# EAGLE schematic Soprano2G-IMU-173 (EAGLE 9.1.3)
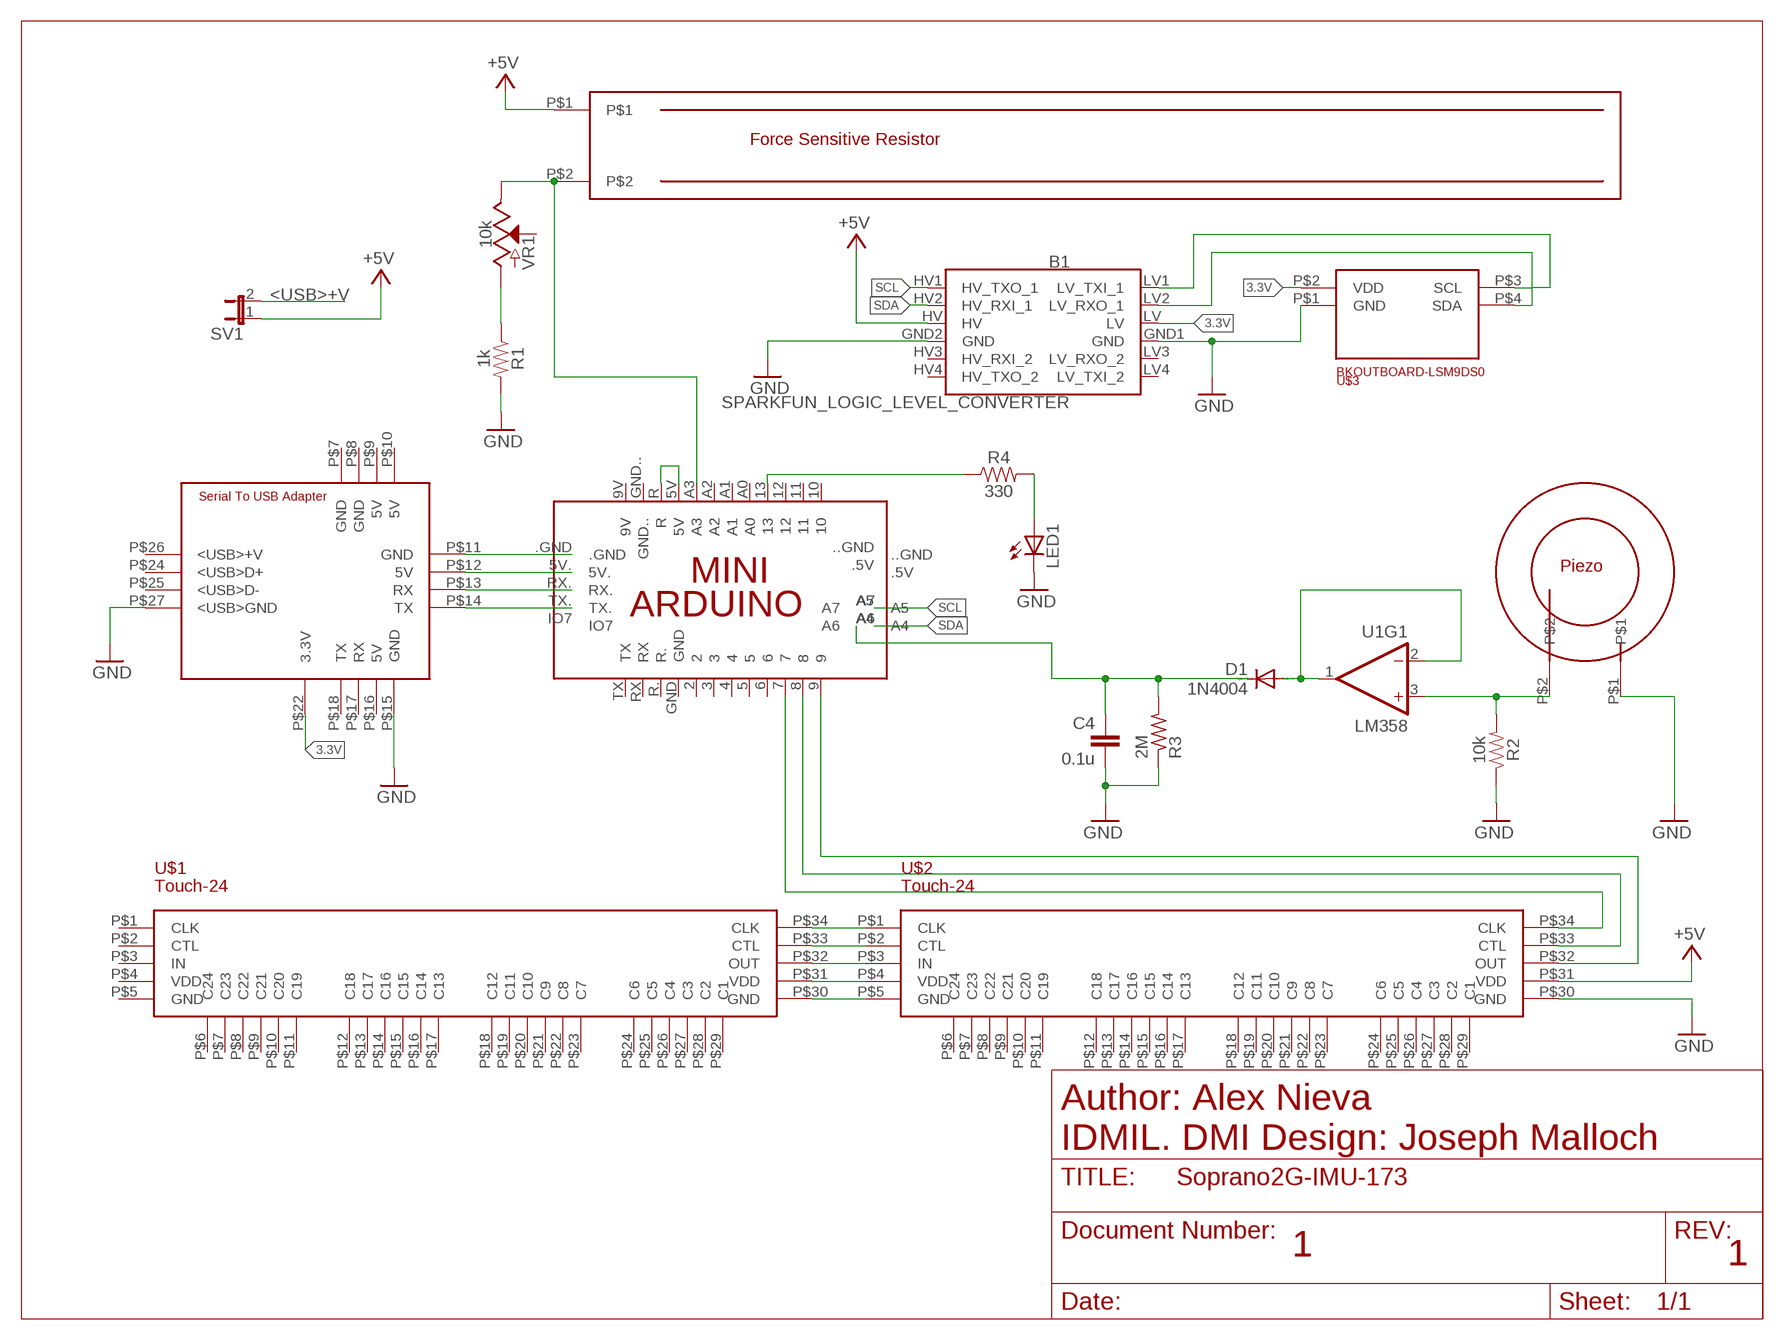
[diagram p0: schematic, sheet 1]

## Parts
B1  SPARKFUN_LOGIC_LEVEL_CONVERTER  [SPARKFUN_LOGIC_LEVEL_CONVERTER]
C4  0.1u  C5/5.5  [C5B5.5]
D1  1N4004  [DO41-10]
LED1  LED3MM  [LED3MM]
PCB1  ARDUINO_MINI  [ARDUINO_MINI]
R1  1k  1KOHM-HORIZ-1/4W-1%  [AXIAL-0.3]
R2  10k  10KOHM-HORIZ-1/4W-1%  [AXIAL-0.3]
R3  2M  R-US_0204/7  [0204/7]
R4  330  1KOHM-HORIZ-1/4W-1%  [AXIAL-0.3]
SV1  JP1E  [JP1]
U1  LM358  [DIP08]
U$1  TOUCH-24TOUCH-24  [TOUCH24]
U$2  TOUCH-24TOUCH-24  [TOUCH24]
U$3  LSM9DS0_IDMIL_BKOUTBOARD  [LSM9DS0_IDMIL_BKOUTBOARD]
U$4  SERIAL_TO_USB_ARDUINO_MINI  [SERIAL_TO_USB_ARDUINO]
U$5  FSR_T-STICK  [FSR_T-STICK]
U$6  PIEZO_TSTICK  [PIEZO_TSTICK]
VR1  10k  POTENTIOMETER-PTH-9MM-1/20W-20%  [POT-PTH-ALPS]

## Nets
3.3V: B1.LV U$3.P$2(VDD) U$4.P$22(3.3V)
+5V [power]: B1.HV PCB1.5V. SV1.1 U$2.P$31(VDD) U$4.P$12(5V) U$5.P$1
<USB>+V [usbvcc]: SV1.2
GND: B1.GND1(GND) B1.GND2(GND) C4.2 LED1.K(C) R1.P$2 R2.P$1 R3.1 U$2.P$30(GND) U$3.P$1(GND) U$4.P$15(GND) U$4.P$27(<USB>GND) U$6.P$1
N$1: U$1.P$34(CLK) U$2.P$1(CLK)
N$2: U$1.P$33(CTL) U$2.P$2(CTL)
N$3: U$1.P$32(OUT) U$2.P$3(IN)
N$4: U$1.P$31(VDD) U$2.P$4(VDD)
N$5: U$1.P$30(GND) U$2.P$5(GND)
N$6: PCB1..GND U$4.P$11(GND)
N$8: PCB1.RX. U$4.P$13(RX)
N$9: PCB1.TX. U$4.P$14(TX)
N$10: PCB1.13 R4.P$1
N$11: LED1.A R4.P$2
N$12: R1.P$1 VR1.P$3(A)
N$13: PCB1.A3 U$5.P$2 VR1.P$1(E)
N$14: D1.A U1.1(OUT) U1.2(-IN)
N$15: C4.1 D1.C PCB1.A6 R3.2
N$16: R2.P$2 U1.3(+IN) U$6.P$2
N$17: PCB1.7 U$2.P$34(CLK)
N$18: PCB1.5V PCB1.R
N$19: PCB1.8 U$2.P$33(CTL)
N$20: PCB1.9 U$2.P$32(OUT)
SCL: B1.HV1(HV_TXO_1) B1.LV1(LV_TXI_1) PCB1.A5 U$3.P$3(SCL)
SDA: B1.HV2(HV_RXI_1) B1.LV2(LV_RXO_1) PCB1.A4 U$3.P$4(SDA)
Unconnected: B1.HV3(HV_RXI_2) B1.HV4(HV_TXO_2) B1.LV3(LV_RXO_2) B1.LV4(LV_TXI_2) PCB1.2 PCB1.3 PCB1.4 PCB1.5 PCB1.6 PCB1.9V PCB1.10 PCB1.11 PCB1.12 PCB1..5V PCB1...GND PCB1.A0 PCB1.A1 PCB1.A2 PCB1.A7 PCB1.GND PCB1.GND.. PCB1.IO7 PCB1.R. PCB1.RX PCB1.TX U1.4(P$V-) U1.5(+IN) U1.6(-IN) U1.7(OUT) U1.8(P$V+) U$1.P$1(CLK) U$1.P$2(CTL) U$1.P$3(IN) U$1.P$4(VDD) U$1.P$5(GND) U$1.P$6(C24) U$1.P$7(C23) U$1.P$8(C22) U$1.P$9(C21) U$1.P$10(C20) U$1.P$11(C19) U$1.P$12(C18) U$1.P$13(C17) U$1.P$14(C16) U$1.P$15(C15) U$1.P$16(C14) U$1.P$17(C13) U$1.P$18(C12) U$1.P$19(C11) U$1.P$20(C10) U$1.P$21(C9) U$1.P$22(C8) U$1.P$23(C7) U$1.P$24(C6) U$1.P$25(C5) U$1.P$26(C4) U$1.P$27(C3) U$1.P$28(C2) U$1.P$29(C1) U$2.P$6(C24) U$2.P$7(C23) U$2.P$8(C22) U$2.P$9(C21) U$2.P$10(C20) U$2.P$11(C19) U$2.P$12(C18) U$2.P$13(C17) U$2.P$14(C16) U$2.P$15(C15) U$2.P$16(C14) U$2.P$17(C13) U$2.P$18(C12) U$2.P$19(C11) U$2.P$20(C10) U$2.P$21(C9) U$2.P$22(C8) U$2.P$23(C7) U$2.P$24(C6) U$2.P$25(C5) U$2.P$26(C4) U$2.P$27(C3) U$2.P$28(C2) U$2.P$29(C1) U$4.P$7(GND) U$4.P$8(GND) U$4.P$9(5V) U$4.P$10(5V) U$4.P$16(5V) U$4.P$17(RX) U$4.P$18(TX) U$4.P$24(<USB>D+) U$4.P$25(<USB>D-) U$4.P$26(<USB>+V) VR1.P$2(S)

## Notes on the sheet
- Author: Alex Nieva
  IDMIL. DMI Design: Joseph Malloch
- 1 | 1

## Library data of the parts
B1 = SparkFun-Boards:SPARKFUN_LOGIC_LEVEL_CONVERTER: SparkFun Logic Level Converter -Bi-Directional This is the mechnical outline for the 3.3V - 5V bi directional logic level converter. *Note, the "LOCK" Package has the header pins staggered by an offset of 5 mils (off center line), so that when you slide a row of standard 0.1" headers into the PTH pads, it will hold position vertically. See the follwing turorial for more information on this type of special footprints: Sneaky Footprints <https://www.sparkfun.com/tutorials/114> SparkFun Products: SparkFun Logic Level Converter - Bi-Directional <https://www.sparkfun.com/products/12009>
C4 = capacitor-wima:C: CAPACITOR naming: grid - package width
D1 = diode:1N4004: DIODE general purpose rectifier, 1 A
LED1 = led:LED: LED OSRAM: - CHIPLED LG R971, LG N971, LY N971, LG Q971, LY Q971, LO R971, LY R971 LH N974, LH R974 LS Q976, LO Q976, LY Q976 LO Q996 - Hyper CHIPLED LW Q18S LB Q993, LB Q99A, LB R99A - SideLED LS A670, LO A670, LY A670, LG A670, LP A670 LB A673, LV A673, LT A673, LW A673 LH A674 LY A675 LS A676, LA A676, LO A676, LY A676, LW A676 LS A679, LY A679, LG A679 - Hyper Micro SIDELED® LS Y876, LA Y876, LO Y876, LY Y876 LT Y87S - SmartLED LW L88C, LW L88S LB L89C, LB L89S, LG L890 LS L89K, LO L89K, LY L89K LS L896, LA L896, LO L896, LY L896 - TOPLED LS T670, LO T670, LY T670, LG T670, LP T670 LSG T670, LSP T670, LSY T670, LOP T670, LYG T670 LG T671, LOG T671, LSG T671 LB T673, LV T673, LT T673, LW T673 LH T674 LS T676, LA T676, LO T676, LY T676, LB T676, LH T676, LSB T676, LW T676 LB T67C, LV T67C, LT T67C, LS T67K, LO T67K, LY T67K, LW E67C LS E67B, LA E67B, LO E67B, LY E67B, LB E67C, LV E67C, LT E67C LW T67C LS T679, LY T679, LG T679 LS T770, LO T770, LY T770, LG T770, LP T770 LB T773, LV T773, LT T773, LW T773 LH T774 LS E675, LA E675, LY E675, LS T675 LS T776, LA T776, LO T776, LY T776, LB T776 LHGB T686 LT T68C, LB T68C - Hyper Mini TOPLED® LB M676 - Mini TOPLED Santana® LG M470 LS M47K, LO M47K, LY M47K Source: http://www.osram.convergy.de LUXEON: - LUMILED® LXK2-PW12-R00, LXK2-PW12-S00, LXK2-PW14-U00, LXK2-PW14-V00 LXK2-PM12-R00, LXK2-PM12-S00, LXK2-PM14-U00 LXK2-PE12-Q00, LXK2-PE12-R00, LXK2-PE12-S00, LXK2-PE14-T00, LXK2-PE14-U00 LXK2-PB12-K00, LXK2-PB12-L00, LXK2-PB12-M00, LXK2-PB14-N00, LXK2-PB14-P00, LXK2-PB14-Q00 LXK2-PR12-L00, LXK2-PR12-M00, LXK2-PR14-Q00, LXK2-PR14-R00 LXK2-PD12-Q00, LXK2-PD12-R00, LXK2-PD12-S00 LXK2-PH12-R00, LXK2-PH12-S00 LXK2-PL12-P00, LXK2-PL12-Q00, LXK2-PL12-R00 Source: www.luxeon.com KINGBRIGHT: KA-3528ASYC Source: www.kingbright.com
PCB1 = E14_Arduino_revC:ARDUINO_MINI: Device for representing an Arduino Mini board with a footprint in an EAGLE design. Created by Dave Young for Element14. More EAGLE documentation at: http://www.element14.com/community/community/knode/cadsoft_eagle
R1 = SparkFun-Resistors:1KOHM: 1kΩ resistor A resistor is a passive two-terminal electrical component that implements electrical resistance as a circuit element. Resistors act to reduce current flow, and, at the same time, act to lower voltage levels within circuits. - Wikipedia; PROD_ID: RES-12182
R2 = SparkFun-Resistors:10KOHM: 10kΩ resistor A resistor is a passive two-terminal electrical component that implements electrical resistance as a circuit element. Resistors act to reduce current flow, and, at the same time, act to lower voltage levels within circuits. - Wikipedia; PROD_ID: RES-12183
R3 = resistor:R-US_: RESISTOR, American symbol
R4 = SparkFun-Resistors:1KOHM: 1kΩ resistor A resistor is a passive two-terminal electrical component that implements electrical resistance as a circuit element. Resistors act to reduce current flow, and, at the same time, act to lower voltage levels within circuits. - Wikipedia; PROD_ID: RES-12182; VALUE: 1k
SV1 = jumper:JP1E: JUMPER
U1 = SparkFun-IC-Amplifiers:LM358: LM358 Jellybean op-amp Datasheet <http://www.sparkfun.com/datasheets/Components/General/LM358.pdf> SparkFun Products Op-Amp (Thru-Hole) - LM358 <https://www.sparkfun.com/products/9456> (COM-09456); PROD_ID: IC-09172
U$1 U$2 = T-Stick:TOUCH-24
U$3 = T-Stick:LSM9DS0_IDMIL_BKOUTBOARD
U$4 = T-Stick:SERIAL_TO_USB_ARDUINO_MINI: Serial to USB adapter for the Arduino mini 04 used in T-Sticks
U$5 = T-Stick:FSR_T-STICK: FSR for the T-Stick DMI
U$6 = T-Stick:PIEZO_TSTICK
VR1 = SparkFun-Resistors:POTENTIOMETER: Potentiometer (Pot) Three-terminal potentiometers, with an adjustable wiper and two adjustable resistors. A pot can be used to create a configurable voltage divider, or as a variable resistor. Variants ALPS_POT and ALPS_POT_KIT - PTH, breadboard compatible, 9mm square pots Rotary Potentiometer - Linear (10k ohm) <https://www.sparkfun.com/products/9288> (COM-09288) The KIT variant exposes copper on only one side of the PTH pad, so the part can only be assembled on one side of the PCB. Useful for beginner soldering kits.; PROD_ID: RES-09177; SF_SKU: COM-09288

## Net classes
1 power: width 0.61 mm, clearance 0.254 mm
3 usbvcc: width 0.356 mm, clearance 0.254 mm